# Altium schematic sheet CME-M5_DevBrd.SchDoc
size A4
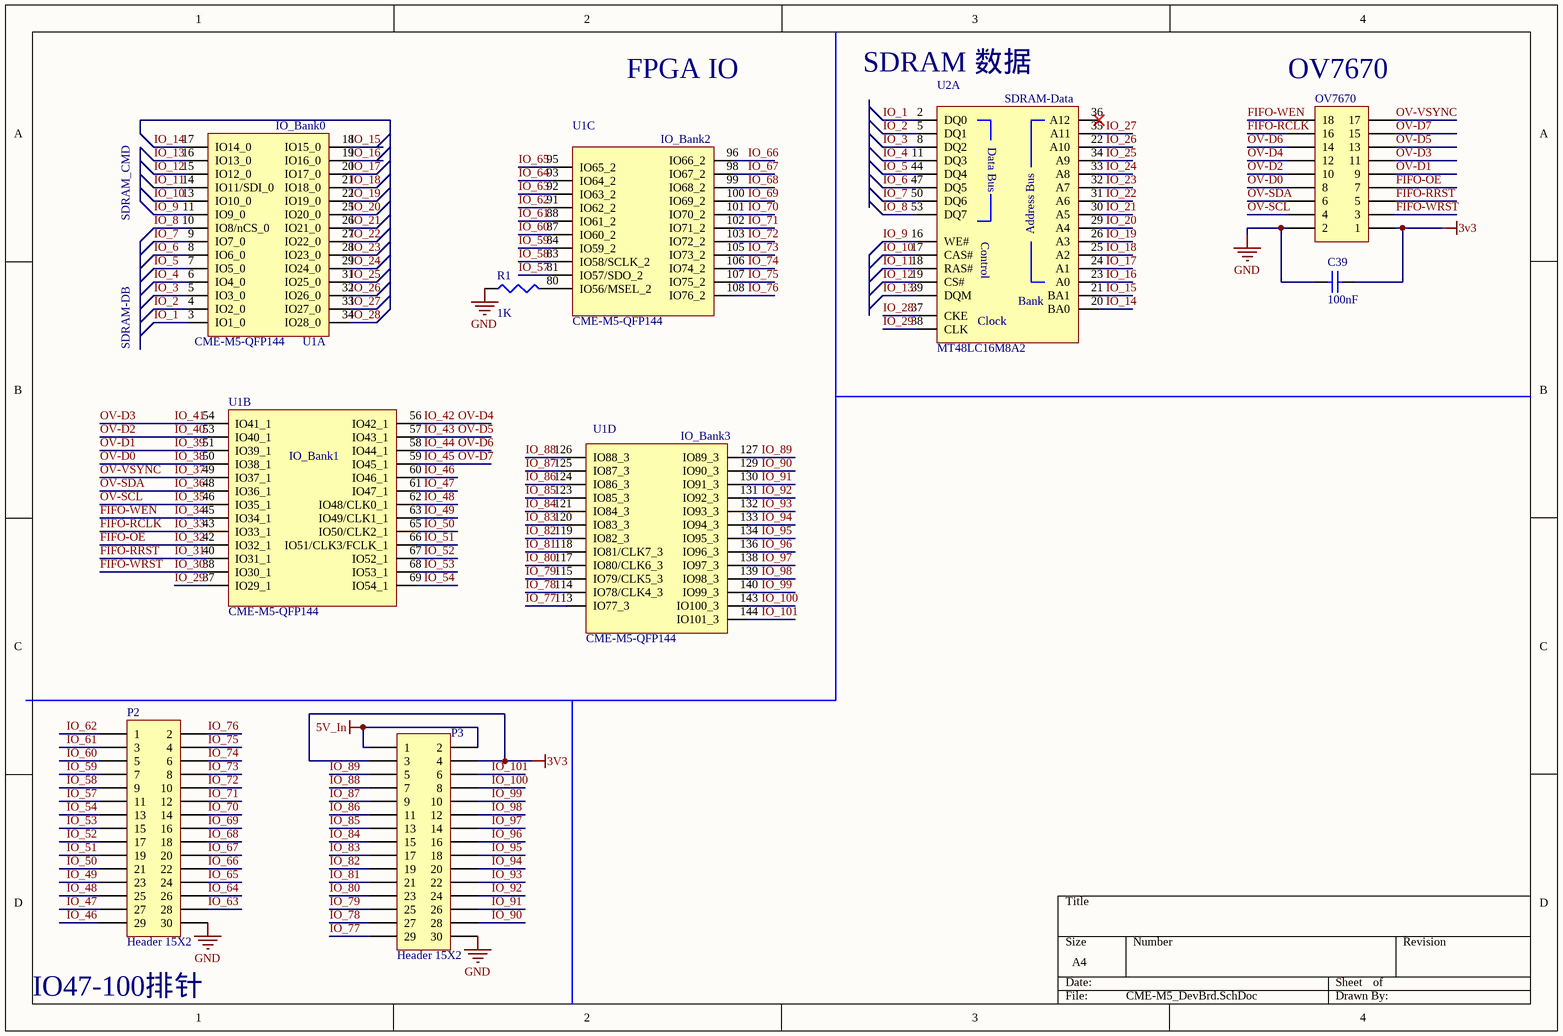
[diagram p0: CME-M5_DevBrd.SchDoc]

## Parts
C39  value 100nF  [6-0805_M]  (hidden comment: Cap)
OV7670  OV7670  [HDR2X9]  (value not drawn)
P2  Header 15X2  [HDR2X15]
P3  Header 15X2  [HDR2X15]
R1  value 1K  [6-0805_M]  (hidden comment: Res3)
U1  CME-M5-QFP144  [QFP144N-50P2200X2200X160]  (parts A,B,C,D of 6)
U2  MT48LC16M8A2  [TSOP54-80P1180X100-]  (part A of 3)

## Nets
3v3: C39.2 OV7670.1 P3.3 P3.4
5V_In: P3.1 P3.2
GND: C39.1 OV7670.2 P2.30 P3.30 R1.1
FIFO-OE: OV7670.7 U1.42(IO32_1)  [also labelled IO_32]
FIFO-RCLK: OV7670.16 U1.43(IO33_1)  [also labelled IO_33]
FIFO-RRST: OV7670.5 U1.40(IO31_1)  [also labelled IO_31]
FIFO-WEN: OV7670.18 U1.45(IO34_1)  [also labelled IO_34]
FIFO-WRST: OV7670.3 U1.38(IO30_1)  [also labelled IO_30]
IO_1: U1.3(IO1_0) U2.2(DQ0)
IO_2: U1.4(IO2_0) U2.5(DQ1)
IO_3: U1.5(IO3_0) U2.8(DQ2)
IO_4: U1.6(IO4_0) U2.11(DQ3)
IO_5: U1.7(IO5_0) U2.44(DQ4)
IO_6: U1.8(IO6_0) U2.47(DQ5)
IO_7: U1.9(IO7_0) U2.50(DQ6)
IO_8: U1.10(IO8/nCS_0) U2.53(DQ7)
IO_9: U1.11(IO9_0) U2.16(WE#)
IO_10: U1.13(IO10_0) U2.17(CAS#)
IO_11: U1.14(IO11/SDI_0) U2.18(RAS#)
IO_12: U1.15(IO12_0) U2.19(CS#)
IO_13: U1.16(IO13_0) U2.39(DQM)
IO_14: U1.17(IO14_0) U2.20(BA0)
IO_15: U1.18(IO15_0) U2.21(BA1)
IO_16: U1.19(IO16_0) U2.23(A0)
IO_17: U1.20(IO17_0) U2.24(A1)
IO_18: U1.21(IO18_0) U2.25(A2)
IO_19: U1.22(IO19_0) U2.26(A3)
IO_20: U1.25(IO20_0) U2.29(A4)
IO_21: U1.26(IO21_0) U2.30(A5)
IO_22: U1.27(IO22_0) U2.31(A6)
IO_23: U1.28(IO23_0) U2.32(A7)
IO_24: U1.29(IO24_0) U2.33(A8)
IO_25: U1.31(IO25_0) U2.34(A9)
IO_26: U1.32(IO26_0) U2.22(A10)
IO_27: U1.33(IO27_0) U2.35(A11)
IO_28: U1.34(IO28_0) U2.37(CKE)
IO_29: U1.37(IO29_1) U2.38(CLK)
IO_35: OV7670.4 U1.46(IO35_1)  [also labelled OV-SCL]
IO_36: OV7670.6 U1.48(IO36_1)  [also labelled OV-SDA]
IO_37: OV7670.17 U1.49(IO37_1)  [also labelled OV-VSYNC]
IO_38: OV7670.8 U1.50(IO38_1)  [also labelled OV-D0]
IO_39: OV7670.9 U1.51(IO39_1)  [also labelled OV-D1]
IO_40: OV7670.10 U1.53(IO40_1)  [also labelled OV-D2]
IO_41: OV7670.11 U1.54(IO41_1)  [also labelled OV-D3]
IO_42: OV7670.12 U1.56(IO42_1)  [also labelled OV-D4]
IO_43: OV7670.13 U1.57(IO43_1)  [also labelled OV-D5]
IO_44: OV7670.14 U1.58(IO44_1)  [also labelled OV-D6]
IO_45: OV7670.15 U1.59(IO45_1)  [also labelled OV-D7]
IO_46: P2.29 U1.60(IO46_1)
IO_47: P2.27 U1.61(IO47_1)
IO_48: P2.25 U1.62(IO48/CLK0_1)
IO_49: P2.23 U1.63(IO49/CLK1_1)
IO_50: P2.21 U1.65(IO50/CLK2_1)
IO_51: P2.19 U1.66(IO51/CLK3/FCLK_1)
IO_52: P2.17 U1.67(IO52_1)
IO_53: P2.15 U1.68(IO53_1)
IO_54: P2.13 U1.69(IO54_1)
IO_57: P2.11 U1.81(IO57/SDO_2)
IO_58: P2.9 U1.83(IO58/SCLK_2)
IO_59: P2.7 U1.84(IO59_2)
IO_60: P2.5 U1.87(IO60_2)
IO_61: P2.3 U1.88(IO61_2)
IO_62: P2.1 U1.91(IO62_2)
IO_63: P2.28 U1.92(IO63_2)
IO_64: P2.26 U1.93(IO64_2)
IO_65: P2.24 U1.95(IO65_2)
IO_66: P2.22 U1.96(IO66_2)
IO_67: P2.20 U1.98(IO67_2)
IO_68: P2.18 U1.99(IO68_2)
IO_69: P2.16 U1.100(IO69_2)
IO_70: P2.14 U1.101(IO70_2)
IO_71: P2.12 U1.102(IO71_2)
IO_72: P2.10 U1.103(IO72_2)
IO_73: P2.8 U1.105(IO73_2)
IO_74: P2.6 U1.106(IO74_2)
IO_75: P2.4 U1.107(IO75_2)
IO_76: P2.2 U1.108(IO76_2)
IO_77: P3.29 U1.113(IO77_3)
IO_78: P3.27 U1.114(IO78/CLK4_3)
IO_79: P3.25 U1.115(IO79/CLK5_3)
IO_80: P3.23 U1.117(IO80/CLK6_3)
IO_81: P3.21 U1.118(IO81/CLK7_3)
IO_82: P3.19 U1.119(IO82_3)
IO_83: P3.17 U1.120(IO83_3)
IO_84: P3.15 U1.121(IO84_3)
IO_85: P3.13 U1.123(IO85_3)
IO_86: P3.11 U1.124(IO86_3)
IO_87: P3.9 U1.125(IO87_3)
IO_88: P3.7 U1.126(IO88_3)
IO_89: P3.5 U1.127(IO89_3)
IO_90: P3.28 U1.129(IO90_3)
IO_91: P3.26 U1.130(IO91_3)
IO_92: P3.24 U1.131(IO92_3)
IO_93: P3.22 U1.132(IO93_3)
IO_94: P3.20 U1.133(IO94_3)
IO_95: P3.18 U1.134(IO95_3)
IO_96: P3.16 U1.136(IO96_3)
IO_97: P3.14 U1.138(IO97_3)
IO_98: P3.12 U1.139(IO98_3)
IO_99: P3.10 U1.140(IO99_3)
IO_100: P3.8 U1.143(IO100_3)
IO_101: P3.6 U1.144(IO101_3)
NetR1_2: R1.2 U1.80(IO56/MSEL_2)

Not connected (* = marked no-connect by the designer): U2 36(A12)*

## Notes on the sheet
- FPGA IO
- (near U2) SDRAM 数据
- (near OV7670) OV7670
- SDRAM_CMD
- SDRAM-DB
- (near P2) IO47-100排针
- (in symbol CME-M5-QFP144, part A) IO_Bank0
- (in symbol CME-M5-QFP144, part B) IO_Bank1
- (in symbol CME-M5-QFP144, part C) IO_Bank2
- (in symbol CME-M5-QFP144, part D) IO_Bank3
- (in symbol SDRAM-8, part A) SDRAM-Data; Data Bus; Address Bus; Control; Bank; Clock

## Library data of the parts
C39 = Cap: Capacitor; Published: 8-Jun-2000; LatestRevisionDate: 17-Jul-2002; LatestRevisionNote: Re-released for DXP Platform.; PackageReference: RAD-0.3; Publisher: Altium Limited; PackageDescription: Radial Cap, Thru-Hole; 2 Leads; 0.3 in Pin Spacing
OV7670 = Header 9X2: Header, 9-Pin, Dual row; LatestRevisionDate: 17-Jul-2002; LatestRevisionNote: Re-released for DXP Platform.; Publisher: Altium Limited
P2 P3 = Header 15X2: Header, 15-Pin, Dual row; LatestRevisionDate: 17-Jul-2002; LatestRevisionNote: Re-released for DXP Platform.; Publisher: Altium Limited
R1 = Res3: Resistor; Published: 8-Jun-2000; LatestRevisionDate: 29-May-2009; LatestRevisionNote: IPC-7351 Footprint Added.; PackageReference: J1-0603; Publisher: Altium Limited; PackageDescription: Chip Resistor
U2 = SDRAM-8